# EAGLE design SimpleKeyboard (EAGLE 7.7.0)
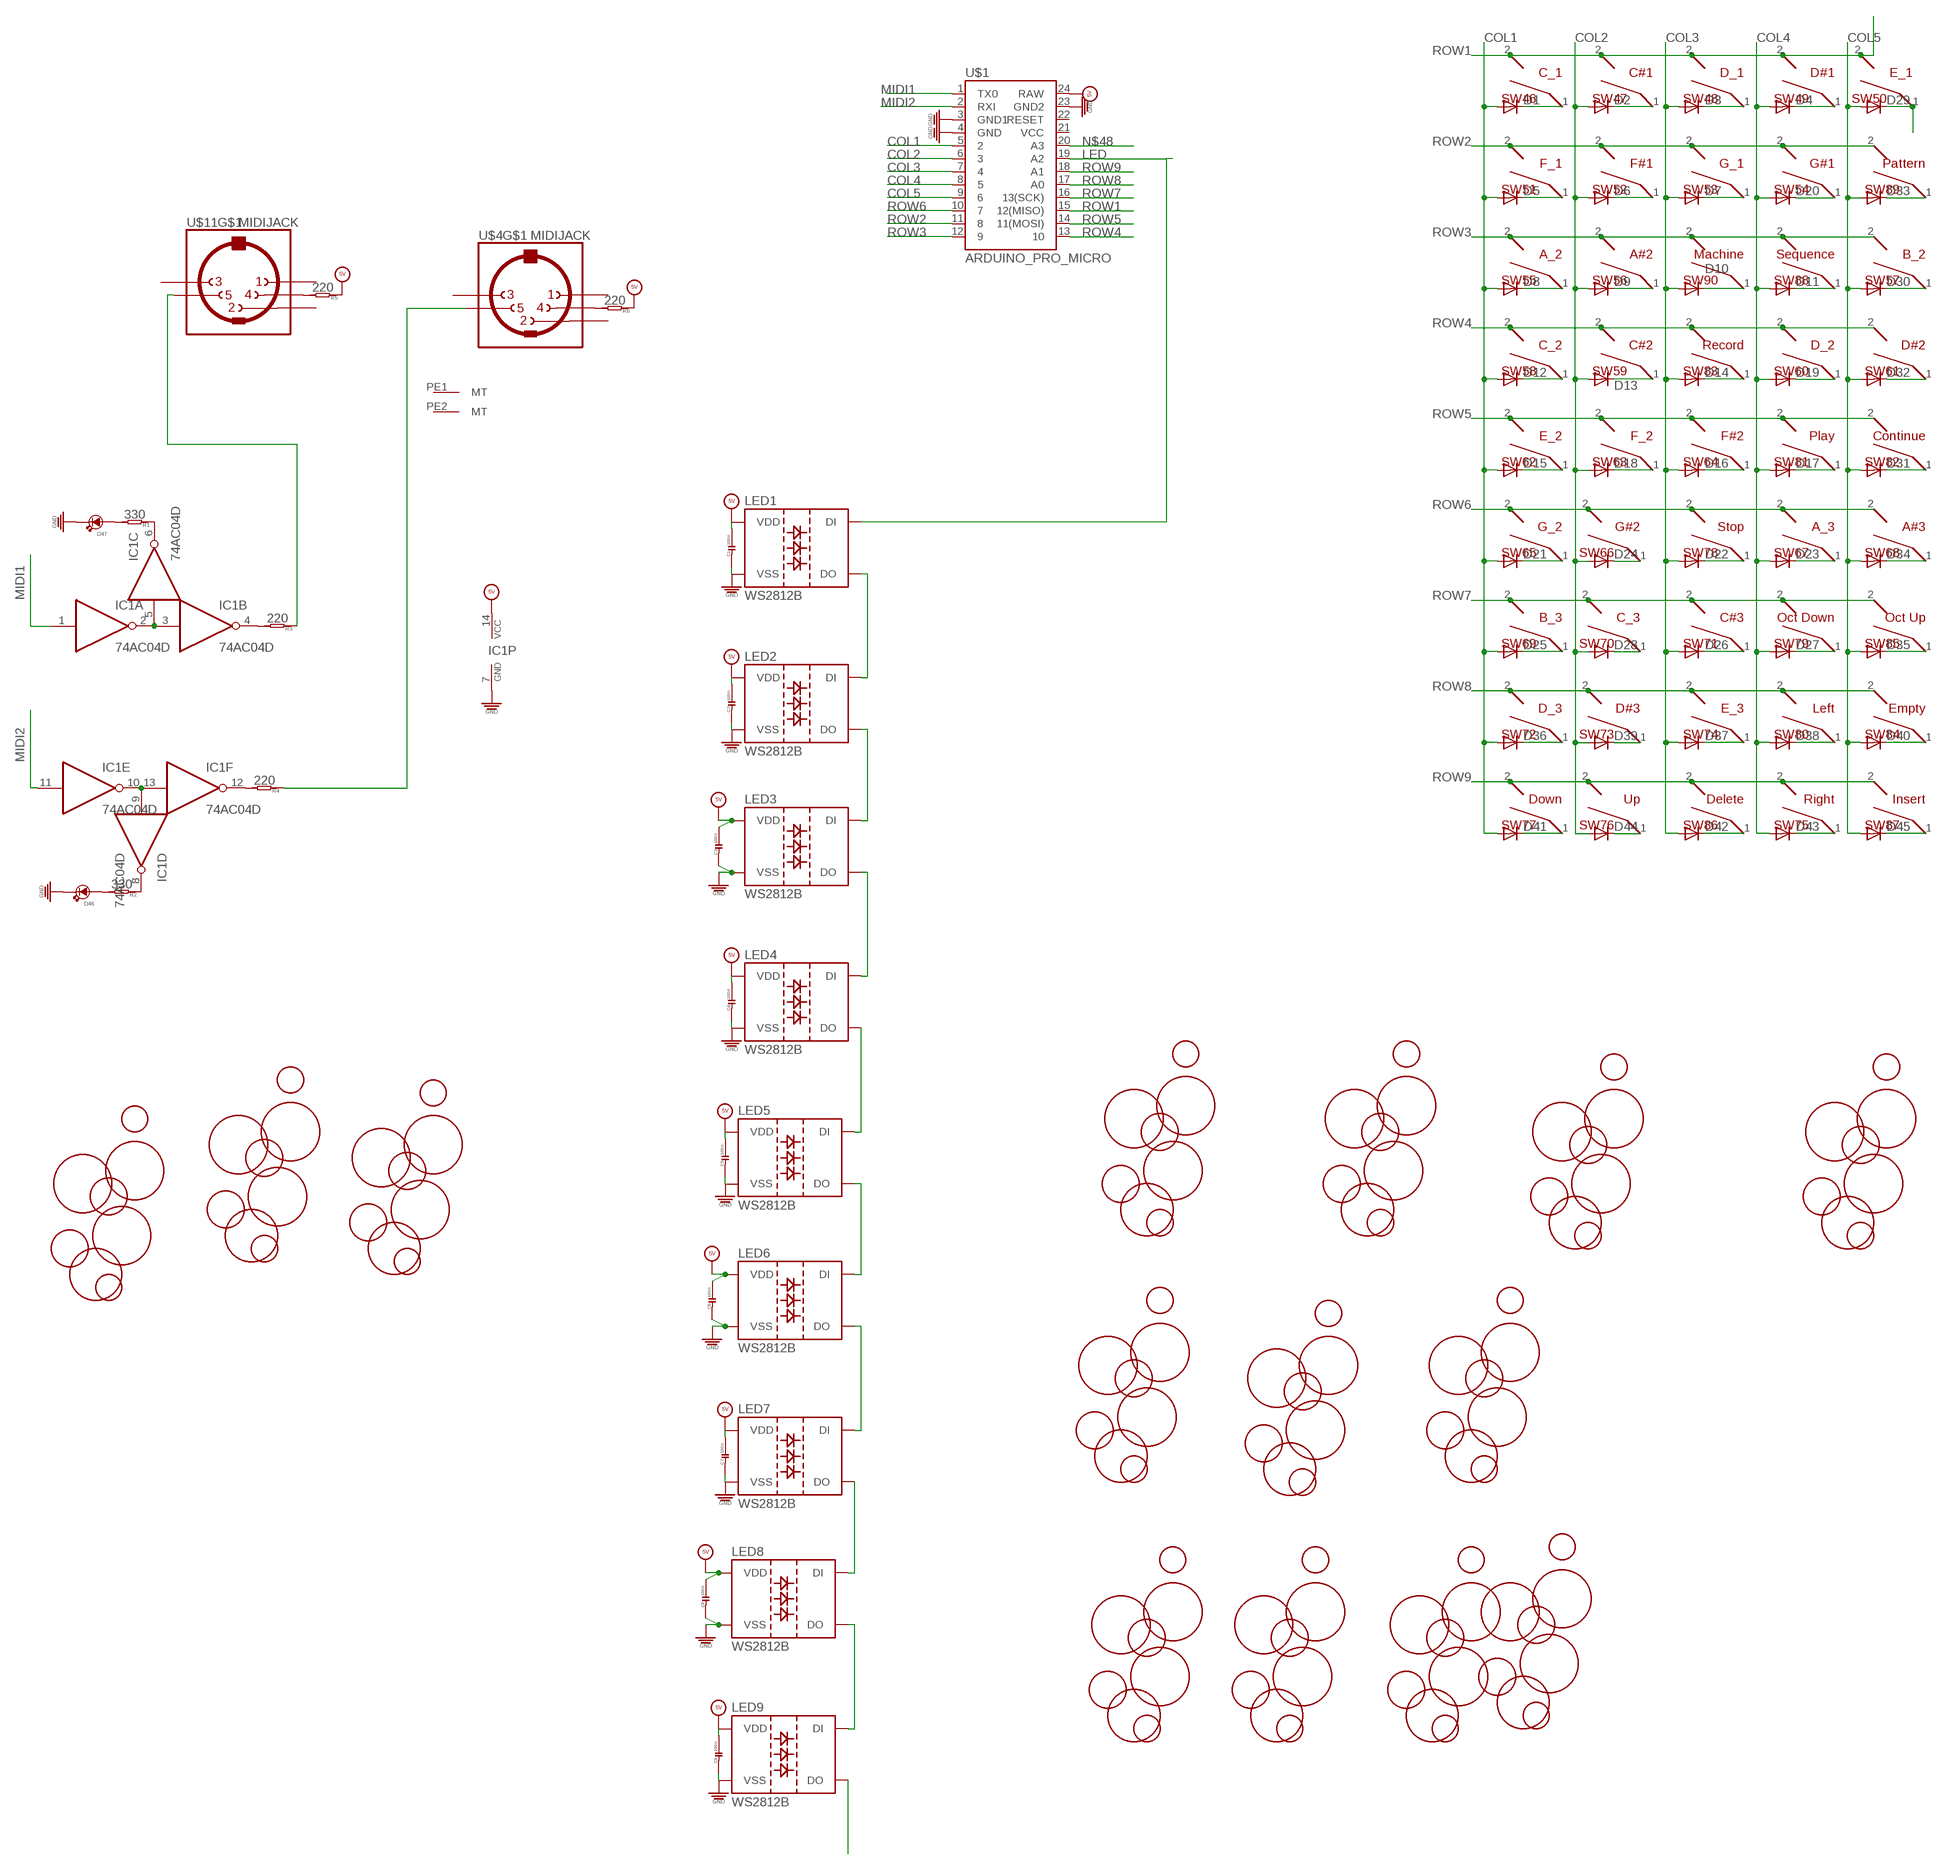
[diagram p0: schematic, sheet 1, part 1 of 2]
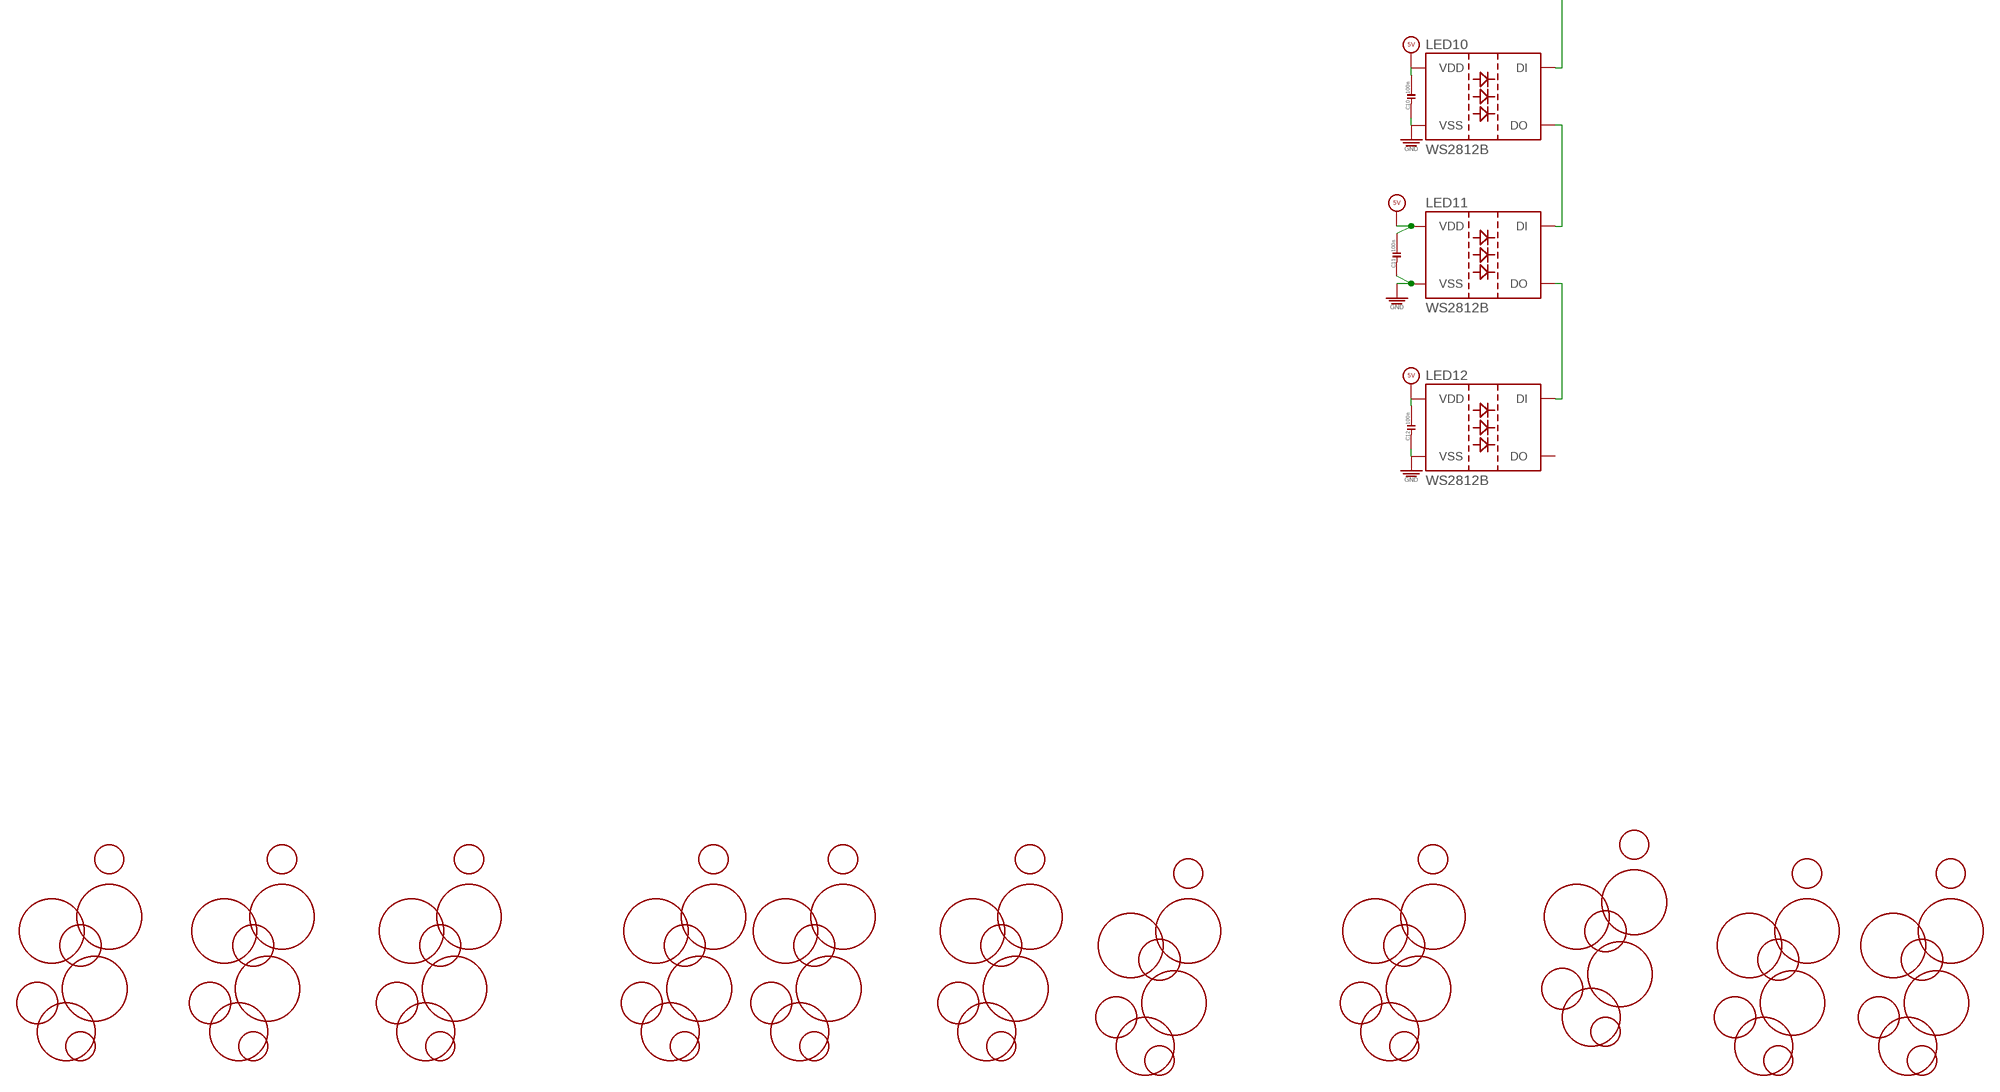
[diagram p1: schematic, sheet 1, part 2 of 2]

## Parts
C1  100n  C-0603  [C0603]
C2  100n  C-0603  [C0603]
C3  100n  C-0603  [C0603]
C4  100n  C-0603  [C0603]
C5  100n  C-0603  [C0603]
C6  100n  C-0603  [C0603]
C7  100n  C-0603  [C0603]
C8  100n  C-0603  [C0603]
C9  100n  C-0603  [C0603]
C10  100n  C-0603  [C0603]
C11  100n  C-0603  [C0603]
C12  100n  C-0603  [C0603]
D1  CGRM4001-G  [SOD-123_MINI-SMA]
D2  CGRM4001-G  [SOD-123_MINI-SMA]
D3  CGRM4001-G  [SOD-123_MINI-SMA]
D4  CGRM4001-G  [SOD-123_MINI-SMA]
D5  CGRM4001-G  [SOD-123_MINI-SMA]
D6  CGRM4001-G  [SOD-123_MINI-SMA]
D7  CGRM4001-G  [SOD-123_MINI-SMA]
D8  CGRM4001-G  [SOD-123_MINI-SMA]
D9  CGRM4001-G  [SOD-123_MINI-SMA]
D10  CGRM4001-G  [SOD-123_MINI-SMA]
D11  CGRM4001-G  [SOD-123_MINI-SMA]
D12  CGRM4001-G  [SOD-123_MINI-SMA]
D13  CGRM4001-G  [SOD-123_MINI-SMA]
D14  CGRM4001-G  [SOD-123_MINI-SMA]
D15  CGRM4001-G  [SOD-123_MINI-SMA]
D16  CGRM4001-G  [SOD-123_MINI-SMA]
D17  CGRM4001-G  [SOD-123_MINI-SMA]
D18  CGRM4001-G  [SOD-123_MINI-SMA]
D19  CGRM4001-G  [SOD-123_MINI-SMA]
D20  CGRM4001-G  [SOD-123_MINI-SMA]
D21  CGRM4001-G  [SOD-123_MINI-SMA]
D22  CGRM4001-G  [SOD-123_MINI-SMA]
D23  CGRM4001-G  [SOD-123_MINI-SMA]
D24  CGRM4001-G  [SOD-123_MINI-SMA]
D25  CGRM4001-G  [SOD-123_MINI-SMA]
D26  CGRM4001-G  [SOD-123_MINI-SMA]
D27  CGRM4001-G  [SOD-123_MINI-SMA]
D28  CGRM4001-G  [SOD-123_MINI-SMA]
D29  CGRM4001-G  [SOD-123_MINI-SMA]
D30  CGRM4001-G  [SOD-123_MINI-SMA]
D31  CGRM4001-G  [SOD-123_MINI-SMA]
D32  CGRM4001-G  [SOD-123_MINI-SMA]
D33  CGRM4001-G  [SOD-123_MINI-SMA]
D34  CGRM4001-G  [SOD-123_MINI-SMA]
D35  CGRM4001-G  [SOD-123_MINI-SMA]
D36  CGRM4001-G  [SOD-123_MINI-SMA]
D37  CGRM4001-G  [SOD-123_MINI-SMA]
D38  CGRM4001-G  [SOD-123_MINI-SMA]
D39  CGRM4001-G  [SOD-123_MINI-SMA]
D40  CGRM4001-G  [SOD-123_MINI-SMA]
D41  CGRM4001-G  [SOD-123_MINI-SMA]
D42  CGRM4001-G  [SOD-123_MINI-SMA]
D43  CGRM4001-G  [SOD-123_MINI-SMA]
D44  CGRM4001-G  [SOD-123_MINI-SMA]
D45  CGRM4001-G  [SOD-123_MINI-SMA]
D46  LED3MM  [3MMLED]
D47  LED3MM  [3MMLED]
IC1  74AC04D  [SO14]
LED1  WS2812B  [WS2812B]
LED2  WS2812B  [WS2812B]
LED3  WS2812B  [WS2812B]
LED4  WS2812B  [WS2812B]
LED5  WS2812B  [WS2812B]
LED6  WS2812B  [WS2812B]
LED7  WS2812B  [WS2812B]
LED8  WS2812B  [WS2812B]
LED9  WS2812B  [WS2812B]
LED10  WS2812B  [WS2812B]
LED11  WS2812B  [WS2812B]
LED12  WS2812B  [WS2812B]
R1  330  R-0603  [R0603]
R2  330  R-0603  [R0603]
R3  220  R-0603  [R0603]
R4  220  R-0603  [R0603]
R5  220  R-0603  [R0603]
R6  220  R-0603  [R0603]
SW46  C_1  CHERRY_MX_WITH_FIXING_PINS  [MX1A-XXNW]
SW47  C#1  CHERRY_MX_WITH_FIXING_PINS  [MX1A-XXNW]
SW48  D_1  CHERRY_MX_WITH_FIXING_PINS  [MX1A-XXNW]
SW49  D#1  CHERRY_MX_WITH_FIXING_PINS  [MX1A-XXNW]
SW50  E_1  CHERRY_MX_WITH_FIXING_PINS  [MX1A-XXNW]
SW51  F_1  CHERRY_MX_WITH_FIXING_PINS  [MX1A-XXNW]
SW52  F#1  CHERRY_MX_WITH_FIXING_PINS  [MX1A-XXNW]
SW53  G_1  CHERRY_MX_WITH_FIXING_PINS  [MX1A-XXNW]
SW54  G#1  CHERRY_MX_WITH_FIXING_PINS  [MX1A-XXNW]
SW55  A_2  CHERRY_MX_WITH_FIXING_PINS  [MX1A-XXNW]
SW56  A#2  CHERRY_MX_WITH_FIXING_PINS  [MX1A-XXNW]
SW57  B_2  CHERRY_MX_WITH_FIXING_PINS  [MX1A-XXNW]
SW58  C_2  CHERRY_MX_WITH_FIXING_PINS  [MX1A-XXNW]
SW59  C#2  CHERRY_MX_WITH_FIXING_PINS  [MX1A-XXNW]
SW60  D_2  CHERRY_MX_WITH_FIXING_PINS  [MX1A-XXNW]
SW61  D#2  CHERRY_MX_WITH_FIXING_PINS  [MX1A-XXNW]
SW62  E_2  CHERRY_MX_WITH_FIXING_PINS  [MX1A-XXNW]
SW63  F_2  CHERRY_MX_WITH_FIXING_PINS  [MX1A-XXNW]
SW64  F#2  CHERRY_MX_WITH_FIXING_PINS  [MX1A-XXNW]
SW65  G_2  CHERRY_MX_WITH_FIXING_PINS  [MX1A-XXNW]
SW66  G#2  CHERRY_MX_WITH_FIXING_PINS  [MX1A-XXNW]
SW67  A_3  CHERRY_MX_WITH_FIXING_PINS  [MX1A-XXNW]
SW68  A#3  CHERRY_MX_WITH_FIXING_PINS  [MX1A-XXNW]
SW69  B_3  CHERRY_MX_WITH_FIXING_PINS  [MX1A-XXNW]
SW70  C_3  CHERRY_MX_WITH_FIXING_PINS  [MX1A-XXNW]
SW71  C#3  CHERRY_MX_WITH_FIXING_PINS  [MX1A-XXNW]
SW72  D_3  CHERRY_MX_WITH_FIXING_PINS  [MX1A-XXNW]
SW73  D#3  CHERRY_MX_WITH_FIXING_PINS  [MX1A-XXNW]
SW74  E_3  CHERRY_MX_WITH_FIXING_PINS  [MX1A-XXNW]
SW75  Right  CHERRY_MX_WITH_FIXING_PINS  [MX1A-XXNW]
SW76  Up  CHERRY_MX_WITH_FIXING_PINS  [MX1A-XXNW]
SW77  Down  CHERRY_MX_WITH_FIXING_PINS  [MX1A-XXNW]
SW78  Stop  CHERRY_MX_WITH_FIXING_PINS  [MX1A-XXNW]
SW79  Oct Down  CHERRY_MX_WITH_FIXING_PINS  [MX1A-XXNW]
SW80  Left  CHERRY_MX_WITH_FIXING_PINS  [MX1A-XXNW]
SW81  Play  CHERRY_MX_WITH_FIXING_PINS  [MX1A-XXNW]
SW82  Continue  CHERRY_MX_WITH_FIXING_PINS  [MX1A-XXNW]
SW83  Record  CHERRY_MX_WITH_FIXING_PINS  [MX1A-XXNW]
SW84  Empty  CHERRY_MX_WITH_FIXING_PINS  [MX1A-XXNW]
SW85  Oct Up  CHERRY_MX_WITH_FIXING_PINS  [MX1A-XXNW]
SW86  Delete  CHERRY_MX_WITH_FIXING_PINS  [MX1A-XXNW]
SW87  Insert  CHERRY_MX_WITH_FIXING_PINS  [MX1A-XXNW]
SW88  Sequence  CHERRY_MX_WITH_FIXING_PINS  [MX1A-XXNW]
SW89  Pattern  CHERRY_MX_WITH_FIXING_PINS  [MX1A-XXNW]
SW90  Machine  CHERRY_MX_WITH_FIXING_PINS  [MX1A-XXNW]
U$1  ARDUINO_PRO_MICRO  [ARDUINO_PRO_MICRO]
U$4  MIDIJACK  [CP-2350]
U$11  MIDIJACK  [CP-2350]
U$15  BUBBLESDSA_1U  [BUBBLES]
U$16  BUBBLESDSA_1U  [BUBBLES]
U$17  BUBBLESDSA_1U  [BUBBLES]
U$18  BUBBLESDSA_1U  [BUBBLES]
U$19  BUBBLESDSA_1U  [BUBBLES]
U$20  BUBBLESDSA_1U  [BUBBLES]
U$21  BUBBLESDSA_1U_HALF  [BUBBLES_HALF]
U$22  BUBBLESDSA_1U_HALF  [BUBBLES_HALF]
U$28  BUBBLESINV  [BUBBLES_INV]
U$29  BUBBLESINV  [BUBBLES_INV]
U$30  BUBBLESINV  [BUBBLES_INV]
U$31  BUBBLESINV  [BUBBLES_INV]
U$32  BUBBLESINV  [BUBBLES_INV]
U$33  BUBBLESDSA_1U_HALF  [BUBBLES_HALF]
U$34  BUBBLESONE  [BUBBLES_ONE]
U$35  BUBBLESONE  [BUBBLES_ONE]
U$36  BUBBLESONE  [BUBBLES_ONE]
U$37  BUBBLESONE  [BUBBLES_ONE]
U$38  BUBBLESONE  [BUBBLES_ONE]
U$39  BUBBLESONE  [BUBBLES_ONE]
U$40  BUBBLESONE  [BUBBLES_ONE]
U$41  BUBBLESONE  [BUBBLES_ONE]
U$42  BUBBLESONE  [BUBBLES_ONE]
U$43  BUBBLESONE  [BUBBLES_ONE]
U$44  BUBBLESONE  [BUBBLES_ONE]

## Nets
5V: C1.2 C2.2 C3.2 C4.2 C5.2 C6.2 C7.2 C8.2 C9.2 C10.2 C11.2 C12.2 IC1.14(P:VCC) LED1.VDD LED2.VDD LED3.VDD LED4.VDD LED5.VDD LED6.VDD LED7.VDD LED8.VDD LED9.VDD LED10.VDD LED11.VDD LED12.VDD R5.1 R6.1 U$1.24(RAW)
COL1: D1.A D5.A D8.A D12.A D15.A D21.A D25.A D36.A D41.A U$1.5
COL2: D2.A D6.A D9.A D13.A D18.A D24.A D28.A D39.A D44.A U$1.6
COL3: D3.A D7.A D10.A D14.A D16.A D22.A D26.A D37.A D42.A U$1.7
COL4: D4.A D11.A D17.A D19.A D20.A D23.A D27.A D38.A D43.A U$1.8
COL5: D29.A D30.A D31.A D32.A D33.A D34.A D35.A D40.A D45.A U$1.9
GND: C1.1 C2.1 C3.1 C4.1 C5.1 C6.1 C7.1 C8.1 C9.1 C10.1 C11.1 C12.1 D46.- D47.- IC1.7(P:GND) LED1.VSS LED2.VSS LED3.VSS LED4.VSS LED5.VSS LED6.VSS LED7.VSS LED8.VSS LED9.VSS LED10.VSS LED11.VSS LED12.VSS U$1.3(GND1) U$1.4(GND) U$1.23(GND2)
LED: LED1.DIN(DI) U$1.19(A2)
MIDI1: IC1.1(A:I) U$1.1(TX0)
MIDI2: IC1.11(E:I) U$1.2(RXI)
N$1: D1.C SW46.1
N$2: D2.C SW47.1
N$3: D3.C SW48.1
N$4: D4.C SW49.1
N$5: D5.C SW51.1
N$6: D6.C SW52.1
N$7: D7.C SW53.1
N$8: D8.C SW55.1
N$9: D9.C SW56.1
N$10: D10.C SW90.1
N$11: D11.C SW88.1
N$12: D12.C SW58.1
N$13: D13.C SW59.1
N$14: D14.C SW83.1
N$15: D15.C SW62.1
N$16: D16.C SW64.1
N$17: D17.C SW81.1
N$18: D18.C SW63.1
N$19: D19.C SW60.1
N$20: D20.C SW54.1
N$21: D21.C SW65.1
N$22: D22.C SW78.1
N$23: D23.C SW67.1
N$24: D24.C SW66.1
N$25: D25.C SW69.1
N$26: D26.C SW71.1
N$27: D27.C SW79.1
N$28: D28.C SW70.1
N$29: D29.C SW50.1
N$30: D30.C SW57.1
N$31: D31.C SW82.1
N$32: D32.C SW61.1
N$33: D33.C SW89.1
N$34: D34.C SW68.1
N$35: D35.C SW85.1
N$36: D36.C SW72.1
N$37: D37.C SW74.1
N$38: D38.C SW80.1
N$39: D39.C SW73.1
N$40: D40.C SW84.1
N$41: D41.C SW77.1
N$42: D42.C SW86.1
N$43: D43.C SW75.1
N$44: D44.C SW76.1
N$45: D45.C SW87.1
N$46: D46.+ R2.2
N$47: LED3.DOUT(DO) LED4.DIN(DI)
N$48: U$1.20(A3)
N$49: LED2.DOUT(DO) LED3.DIN(DI)
N$50: LED1.DOUT(DO) LED2.DIN(DI)
N$51: LED8.DOUT(DO) LED9.DIN(DI)
N$52: LED6.DOUT(DO) LED7.DIN(DI)
N$53: LED5.DOUT(DO) LED6.DIN(DI)
N$54: LED4.DOUT(DO) LED5.DIN(DI)
N$55: IC1.2(A:O) IC1.3(B:I) IC1.5(C:I)
N$56: IC1.9(D:I) IC1.10(E:O) IC1.13(F:I)
N$57: IC1.6(C:O) R1.1
N$58: IC1.8(D:O) R2.1
N$59: D47.+ R1.2
N$60: IC1.4(B:O) R3.2
N$61: IC1.12(F:O) R4.2
N$62: R5.2 U$11.4
N$63: R6.2 U$4.4
N$64: R3.1 U$11.5
N$65: R4.1 U$4.5
N$66: LED7.DOUT(DO) LED8.DIN(DI)
N$67: LED11.DOUT(DO) LED12.DIN(DI)
N$68: LED10.DOUT(DO) LED11.DIN(DI)
N$69: LED9.DOUT(DO) LED10.DIN(DI)
ROW1: SW46.2 SW47.2 SW48.2 SW49.2 SW50.2 U$1.15(12(MISO))
ROW2: SW51.2 SW52.2 SW53.2 SW54.2 SW89.2 U$1.11
ROW3: SW55.2 SW56.2 SW57.2 SW88.2 SW90.2 U$1.12
ROW4: SW58.2 SW59.2 SW60.2 SW61.2 SW83.2 U$1.13
ROW5: SW62.2 SW63.2 SW64.2 SW81.2 SW82.2 U$1.14(11(MOSI))
ROW6: SW65.2 SW66.2 SW67.2 SW68.2 SW78.2 U$1.10
ROW7: SW69.2 SW70.2 SW71.2 SW79.2 SW85.2 U$1.16(13(SCK))
ROW8: SW72.2 SW73.2 SW74.2 SW80.2 SW84.2 U$1.17(A0)
ROW9: SW75.2 SW76.2 SW77.2 SW86.2 SW87.2 U$1.18(A1)
Unconnected: LED12.DOUT(DO) U$1.21(VCC) U$1.22(RESET) U$4.1 U$4.2 U$4.3 U$4.PE1(MT) U$4.PE2(MT) U$4.PE(MT) U$4.PE@(MT) U$11.1 U$11.2 U$11.3 U$11.PE1(MT) U$11.PE2(MT) U$11.PE(MT) U$11.PE@(MT)

## Library data of the parts
C1-C12 = OPL:C*
D1-D45 = diode:CGRM400*-G: Molded plasitc,JEDEC SOD-123/Mini SMA Source: Comchip CGRM4001-G.pdf
D46 D47 = EurorackModularParts:LED*: LED
IC1 = 74xx-eu:74*04: Hex INVERTER
LED1-LED12 = WS2812:WS2812B
R1-R6 = OPL:R*
SW46-SW90 = Cherry_MX_v7.0:CHERRY_MX
U$1 = SparkFun-Boards:ARDUINO_PRO_MICRO
U$4 U$11 = adafruit:MIDIJACK: DIN 5 jack also known as MIDI jack A modification of conn-hirshman:MAB5SH with two options for the grounding 'teeth'
U$15-U$22 U$28-U$44 = EurorackModularParts:BUBBLES

## Net classes
0 default: width 0.381 mm

## Board
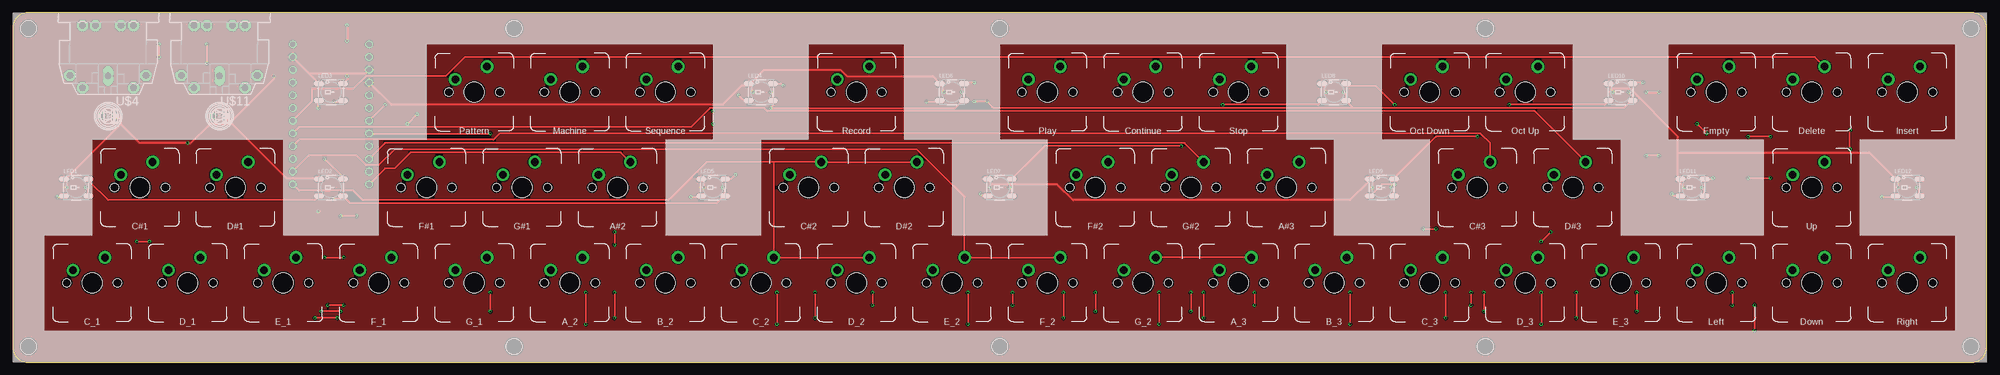
[diagram p2: board, top side]
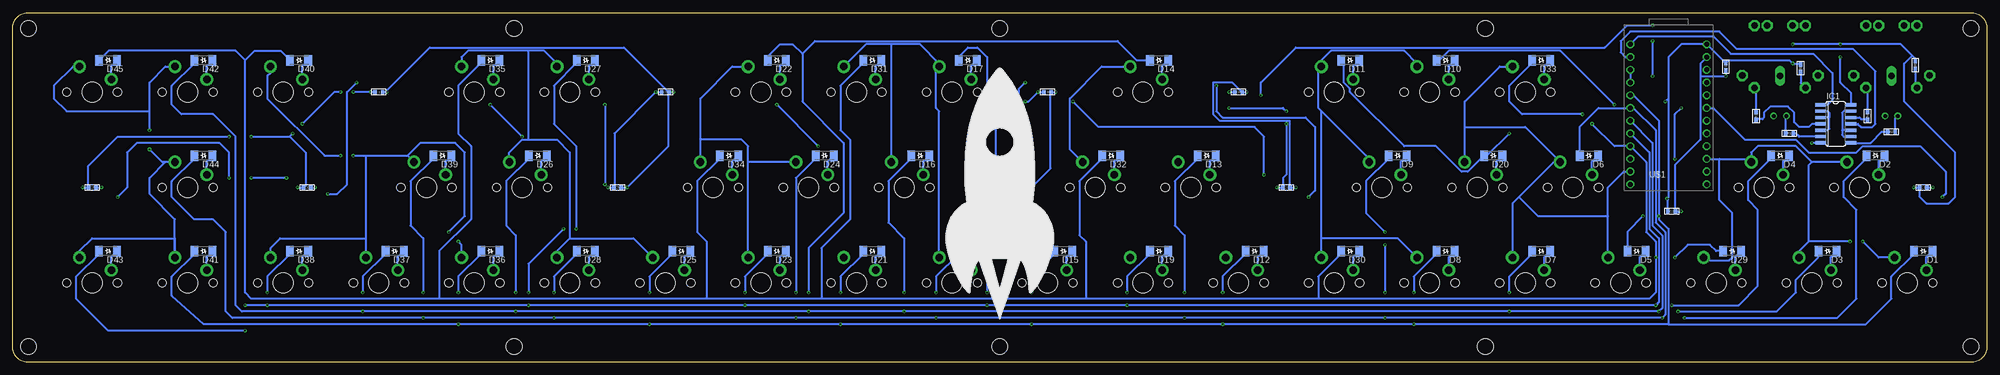
[diagram p3: board, bottom side, seen from below]

Size 393.7 x 69.85 mm. Coordinates in mm from the lower left corner, seen from the top.
Outline: 0,66.67 0,3.17 arc90 3.17,0 390.53,0 arc90 393.7,3.17 393.7,66.67 arc90 390.53,69.85 3.17,69.85 arc90 0,66.67
Copper layers (1*16): Top 0.035mm / dielectric 1.5mm / Bottom 0.035mm
Design rules "dirt_cheap_dirty_boards.v1": minimum track width 5mil, minimum drill 12mil, track to track 5mil, track to pad 5mil, pad to pad 5mil, via to via 5mil, smd to smd 0mil, copper to edge 10mil, drill to drill 10mil, minimum pad ring 10mil, minimum via ring 6mil, stop-mask expansion 2mil, vias tented up to drill 25mil, thermal gap 10mil
Holes 3.2 mm at 3.17,66.67 3.17,3.17 390.53,66.67 196.85,3.17 196.85,66.67 390.53,3.17 100.01,3.17 100.01,66.67 293.69,3.17 293.69,66.67

### Footprints (pad centres in the part's own frame; a part is rotated, then mirrored left to right if it is on the bottom)
C0603 = smd 0.889 x 0.889: 1 -0.762,0; 2 0.762,0
SOD-123_MINI-SMA = smd 1.5 x 2.1: A 1.8,0; C -1.8,0
3MMLED = drill 0.8: + -1.27,0; - 1.27,0
SO14 = smd 0.66 x 2.032: 1 -3.81,-3.073; 2 -2.54,-3.073; 3 -1.27,-3.073; 4 0,-3.073; 5 1.27,-3.073; 6 2.54,-3.073; 7 3.81,-3.073; 8 3.81,3.073; 9 2.54,3.073; 10 1.27,3.073; 11 0,3.073; 12 -1.27,3.073; 13 -2.54,3.073; 14 -3.81,3.073
WS2812B = smd 2 x 1.1: DIN -2.4,-1.7; DOUT 2.4,1.7; VDD 2.4,-1.7; VSS -2.4,1.7
R0603 = smd 0.889 x 0.889: 1 -0.762,0; 2 0.762,0
MX1A-XXNW = drill 1.5 pad 2.54: 1 -3.81,2.54; 2 2.54,5.08 | hole 4: 0,0 | hole 1.7: -5.08,0; 5.08,0
ARDUINO_PRO_MICRO = drill 1.016: 1 -7.62,12.7; 2 -7.62,10.16; 3 -7.62,7.62; 4 -7.62,5.08; 5 -7.62,2.54; 6 -7.62,0; 7 -7.62,-2.54; 8 -7.62,-5.08; 9 -7.62,-7.62; 10 -7.62,-10.16; 11 -7.62,-12.7; 12 -7.62,-15.24; 13 7.62,-15.24; 14 7.62,-12.7; 15 7.62,-10.16; 16 7.62,-7.62; 17 7.62,-5.08; 18 7.62,-2.54; 19 7.62,0; 20 7.62,2.54; 21 7.62,5.08; 22 7.62,7.62; 23 7.62,10.16; 24 7.62,12.7
CP-2350 = drill 1.321 pad 2.184 octagon: 1 7.62,12.58; 3 -7.52,12.58; 4 5.08,15.02; 5 -5.08,15.02; PE -2.54,2.62; PE1 -5.08,2.62; PE2 5.08,2.62; PE@ 2.54,2.62 | drill 1.321 long: 2 0,12.68

### Placement (x,y rotation side)
C1  12.7,34.92 180 bottom
C2  62.86,30.16 180 bottom
C3  139.7,34.92 180 bottom
C4  196.85,34.92 180 bottom
C5  273.05,34.92 180 bottom
C6  334.96,34.92 180 bottom
C7  377.82,34.92 180 bottom
C8  149.23,53.97 180 bottom
C9  263.53,53.97 180 bottom
C10  187.33,53.97 180 bottom
C11  320.68,53.97 180 bottom
C12  52.07,59.05 90 bottom
D1  12.7,22.23 180 bottom
D2  22.23,41.27 180 bottom
D3  31.75,22.23 180 bottom
D4  41.27,41.27 180 bottom
D5  69.85,22.23 180 bottom
D6  79.38,41.27 180 bottom
D7  88.9,22.23 180 bottom
D8  107.95,22.23 180 bottom
D9  117.47,41.27 180 bottom
D10  107.95,60.32 180 bottom
D11  127,60.32 180 bottom
D12  146.05,22.23 180 bottom
D13  155.58,41.27 180 bottom
D14  165.1,60.32 180 bottom
D15  184.15,22.23 180 bottom
D16  212.73,41.27 180 bottom
D17  203.2,60.32 180 bottom
D18  203.2,22.23 180 bottom
D19  165.1,22.23 180 bottom
D20  98.42,41.27 180 bottom
D21  222.25,22.23 180 bottom
D22  241.3,60.32 180 bottom
D23  241.3,22.23 180 bottom
D24  231.78,41.27 180 bottom
D25  260.35,22.23 180 bottom
D26  288.93,41.27 180 bottom
D27  279.4,60.32 180 bottom
D28  279.4,22.23 180 bottom
D29  50.8,22.23 180 bottom
D30  127,22.23 180 bottom
D31  222.25,60.32 180 bottom
D32  174.62,41.27 180 bottom
D33  88.9,60.32 180 bottom
D34  250.83,41.27 180 bottom
D35  298.45,60.32 180 bottom
D36  298.45,22.23 180 bottom
D37  317.5,22.23 180 bottom
D38  336.55,22.23 180 bottom
D39  307.98,41.27 180 bottom
D40  336.55,60.32 180 bottom
D41  355.6,22.23 180 bottom
D42  355.6,60.32 180 bottom
D43  374.65,22.23 180 bottom
D44  355.6,41.27 180 bottom
D45  374.65,60.32 180 bottom
D46  19.05,49.21 0 top
D47  41.27,49.21 0 top
IC1  30.16,47.62 270 bottom
LED1  12.7,34.92 0 top
LED2  63.5,34.92 0 top
LED3  63.5,53.97 0 top
LED4  149.23,53.97 0 top
LED5  139.7,34.92 0 top
LED6  187.33,53.97 0 top
LED7  196.85,34.92 0 top
LED8  263.53,53.97 0 top
LED9  273.05,34.92 0 top
LED10  320.68,53.97 0 top
LED11  334.96,34.92 0 top
LED12  377.82,34.92 0 top
R1  39.37,45.72 180 bottom
R2  19.05,46.04 0 bottom
R3  46.04,49.21 270 bottom
R4  23.81,49.21 270 bottom
R5  37.15,58.74 270 bottom
R6  14.29,59.37 270 bottom
SW46  15.88,15.88 0 top
SW47  25.4,34.92 0 top
SW48  34.92,15.88 0 top
SW49  44.45,34.92 0 top
SW50  53.97,15.88 0 top
SW51  73.02,15.88 0 top
SW52  82.55,34.92 0 top
SW53  92.08,15.88 0 top
SW54  101.6,34.92 0 top
SW55  111.12,15.88 0 top
SW56  120.65,34.92 0 top
SW57  130.18,15.88 0 top
SW58  149.23,15.88 0 top
SW59  158.75,34.92 0 top
SW60  168.28,15.88 0 top
SW61  177.8,34.92 0 top
SW62  187.33,15.88 0 top
SW63  206.38,15.88 0 top
SW64  215.9,34.92 0 top
SW65  225.43,15.88 0 top
SW66  234.95,34.92 0 top
SW67  244.48,15.88 0 top
SW68  254,34.92 0 top
SW69  263.53,15.88 0 top
SW70  282.57,15.88 0 top
SW71  292.1,34.92 0 top
SW72  301.62,15.88 0 top
SW73  311.15,34.92 0 top
SW74  320.68,15.88 0 top
SW75  377.82,15.88 0 top
SW76  358.78,34.92 0 top
SW77  358.78,15.88 0 top
SW78  244.48,53.97 0 top
SW79  282.57,53.97 0 top
SW80  339.73,15.88 0 top
SW81  206.38,53.97 0 top
SW82  225.43,53.97 0 top
SW83  168.28,53.97 0 top
SW84  339.73,53.97 0 top
SW85  301.62,53.97 0 top
SW86  358.78,53.97 0 top
SW87  377.82,53.97 0 top
SW88  130.18,53.97 0 top
SW89  92.08,53.97 0 top
SW90  111.12,53.97 0 top
U$1  63.5,50.8 0 bottom
U$4  19.05,69.85 180 top
U$11  41.27,69.85 180 top
U$15  63.5,34.92 0 top
U$16  139.7,34.92 0 top
U$17  196.85,34.92 0 top
U$18  273.05,34.92 90 top
U$19  377.82,34.92 90 top
U$20  330.2,34.92 0 top
U$21  9.52,34.92 0 top
U$22  342.9,34.92 180 top
U$28  73.02,53.97 0 top
U$29  149.23,53.97 90 top
U$30  187.33,53.97 0 top
U$31  263.53,53.97 0 top
U$32  320.68,53.97 90 top
U$33  63.5,53.97 180 top
U$34  327.03,44.45 0 top
U$35  193.68,44.45 0 top
U$36  60.32,44.45 0 top
U$37  142.88,44.45 0 top
U$38  66.67,44.45 0 top
U$39  57.15,53.97 0 top
U$40  57.15,47.62 0 top
U$41  57.15,60.32 0 top
U$42  269.88,44.45 0 top
U$43  346.07,31.75 0 top
U$44  346.07,38.1 0 top
U$45  [ROCKET-5CM]  196.85,31.75 0 bottom

### Tracks (layer width: path | path; a pad name or v marks a point on that pad's centre or on a via)
5V  (via drill 0.3)
  Top 0.381: v63.82,32.7 65.38,32.7 LED2.VDD 66.04,33.02 67.31,31.75 140.34,31.75 141.61,33.02 LED5.VDD 142.1,34.43 v141.61,34.92 | v151.13,53.97 151.62,53.48 LED4.VDD 151.62,51.29 v151.13,50.8 187.96,50.8 189.23,52.07 LED6.VDD 189.73,53.48 v189.23,53.97 | LED7.VDD 199.25,34.43 v198.76,34.92 | v265.43,53.97 265.93,53.48 LED8.VDD 266.06,52.07 267.34,50.8 | LED9.VDD 275.45,34.43 v274.95,34.92 | LED11.VDD 337.36,34.43 v336.87,34.92 | v322.26,53.97 323.07,53.16 LED10.VDD 322.58,52.07 321.31,50.8 267.34,50.8 | LED12.VDD 380.23,34.43 v379.73,34.92 | LED1.VDD 15.1,34.43 v14.61,34.92 | v64.14,52.07 65.7,52.07 LED3.VDD | v38.73,63.5 v38.73,59.69 | v29.21,60.96 v29.21,63.5 | v139.7,50.16 v139.7,47.62 | v191.77,52.07 v194.31,52.07 195.58,50.8 267.34,50.8 | v350.52,45.08 v346.07,45.08 | v325.75,53.97 v328.3,53.97 | v335.92,47.62 v337.82,45.72
  Bottom 0.381: C2.2 63.63,32.51 v63.82,32.7 63.5,33.02 63.5,52.7 | v151.13,53.97 C8.2 | C10.2 v189.23,53.97 191.14,52.07 v191.77,52.07 | v198.76,34.92 C4.2 197.61,48.77 v194.31,52.07 | C9.2 v265.43,53.97 273.69,45.72 273.69,34.92 C5.2 v274.95,34.92 | v336.87,34.92 C6.2 335.28,35.37 335.28,41.91 338.45,45.08 | v322.26,53.97 C11.2 v325.75,53.97 | v379.73,34.92 C7.2 378.59,39.24 372.75,45.08 v350.52,45.08 | v14.61,34.92 C1.2 13.46,33.15 12.07,31.75 7.62,31.75 6.35,33.02 6.35,41.91 16.51,52.07 16.51,59.69 14.92,61.28 | 63.5,52.7 63.5,60.96 60.96,63.5 U$1.24 52.39,60.01 C12.2 52.26,59.5 51.43,60.32 39.37,60.32 v38.73,59.69 37.34,59.69 R5.1 | 63.5,52.7 v64.14,52.07 | R6.1 14.29,60.64 14.92,61.28 | 14.92,61.28 17.14,63.5 v29.21,63.5 v38.73,63.5 | IC1.14 27.09,53.76 29.21,55.88 v29.21,60.96 | v141.61,34.92 C3.2 140.34,35.05 140.34,36.83 139.7,37.46 v139.7,47.62 | v151.13,50.8 140.34,50.8 v139.7,50.16 | v346.07,45.08 338.45,45.08 | v328.3,53.97 329.56,53.97 v335.92,47.62 | v337.82,45.72 338.45,45.08
COL1  (via drill 0.3)
  Top 0.381: v114.3,13.97 v114.3,7.62 | v152.4,13.97 v152.4,7.62 | v190.5,13.97 v190.5,7.62 | v228.6,13.97 v228.6,7.62 | v266.7,13.97 v266.7,7.62 | v304.8,13.97 v304.8,7.62 | v68.58,29.21 v65.41,29.21
  Bottom 0.381: U$1.5 70.48,53.34 65.41,48.26 v65.41,29.21 65.41,28.57 63.5,26.67 63.5,7.62 | 63.5,7.62 24.13,7.62 19.05,12.7 19.05,17.14 14.61,21.59 14.61,22.12 D1.A | 63.5,7.62 v114.3,7.62 v152.4,7.62 v190.5,7.62 v228.6,7.62 v266.7,7.62 v304.8,7.62 355.6,7.62 361.95,13.34 361.95,17.14 357.5,21.59 357.5,22.12 D41.A | D8.A 109.75,21.7 114.3,17.14 v114.3,13.97 | D12.A 147.85,21.7 152.4,17.14 v152.4,13.97 | D15.A 185.95,21.7 190.5,17.14 v190.5,13.97 | D21.A 224.05,21.7 228.6,17.14 v228.6,13.97 | D25.A 262.15,21.7 266.7,17.14 v266.7,13.97 | D36.A 300.25,21.7 304.8,17.14 v304.8,13.97 | D5.A 71.65,26.14 v68.58,29.21
COL2  (via drill 0.3)
  Top 0.381: v64.77,8.89 v60.32,8.89 | v209.55,13.97 v209.55,8.89 | v285.75,13.97 v285.75,8.89 | v237.49,13.97 v237.49,8.89 | v120.02,26.04 v120.02,23.5 | v120.02,13.97 v120.02,8.89 | v160.02,13.97 v160.02,8.89 | v311.79,13.97 v311.79,8.89
  Bottom 0.381: v60.32,8.89 29.85,8.89 26.04,12.7 26.04,30.48 28.57,33.02 28.57,36.2 24.13,40.64 24.13,41.17 D2.A | D44.A 357.5,41.17 357.5,40.64 361.95,36.2 361.95,33.02 357.5,28.57 353.69,28.57 351.16,26.04 351.16,10.16 349.88,8.89 v311.79,8.89 v285.75,8.89 v237.49,8.89 v209.55,8.89 v160.02,8.89 v120.02,8.89 v64.77,8.89 64.14,9.52 64.14,26.04 66.04,27.94 66.04,46.35 70.48,50.8 U$1.6 77.47,50.8 81.17,47.09 D6.A | D18.A 205,21.7 209.55,17.14 v209.55,13.97 | D28.A 281.2,21.7 285.75,17.14 v285.75,13.97 | D24.A 233.58,40.74 237.49,36.83 v237.49,13.97 | D9.A 119.27,40.74 123.83,36.2 123.83,29.85 v120.02,26.04 | v120.02,23.5 v120.02,13.97 | D13.A 157.38,40.74 161.93,36.2 161.93,27.3 160.02,25.4 v160.02,13.97 | D39.A 309.78,40.74 314.32,36.2 314.32,27.3 311.79,24.77 v311.79,13.97
COL3  (via drill 0.3)
  Top 0.381: v65.41,10.16 v61.59,10.16 | v95.25,13.97 v95.25,10.16 | v323.85,13.97 v323.85,10.16 | v215.9,13.97 v215.9,10.16 | v293.37,13.97 v293.37,10.16 | v234.95,13.97 v234.95,10.16 | U$1.7 v74.3,51.43
  Bottom 0.381: U$1.7 66.67,43.81 66.67,27.3 64.77,25.4 64.77,10.79 v65.41,10.16 v95.25,10.16 v215.9,10.16 v234.95,10.16 v293.37,10.16 v323.85,10.16 347.98,10.16 349.25,11.43 349.25,45.08 353.69,49.53 360.05,49.53 361.95,51.43 361.95,55.24 357.5,59.69 357.5,60.22 D42.A | v61.59,10.16 41.91,10.16 38.1,13.97 38.1,16.51 33.66,20.96 33.66,22.12 D3.A | v95.25,13.97 95.25,17.14 90.8,21.59 90.8,22.12 D7.A | D37.A 319.3,21.7 323.85,17.14 v323.85,13.97 | D16.A 214.53,40.74 219.08,36.2 219.08,27.94 215.9,24.77 v215.9,13.97 | D26.A 290.73,40.74 295.28,36.2 295.28,27.3 293.37,25.4 v293.37,13.97 | D22.A 243.1,61.06 240.67,63.5 238.12,63.5 236.22,61.59 | 236.22,61.59 236.22,52.07 227.97,43.81 227.97,29.85 234.95,22.86 v234.95,13.97 | v74.3,51.43 85.09,62.23 107.31,62.23 109.22,60.32 D10.A | D14.A 169.55,60.32 173.36,64.14 233.68,64.14 236.22,61.59
COL4  (via drill 0.3)
  Top 0.381: v66.04,11.43 v62.86,11.43 | v347.35,11.43 v347.35,6.35 | v171.45,13.97 v171.45,11.43 | v247.65,13.97 v247.65,11.43 | v342.9,13.97 v342.9,11.43 | v199.39,13.97 v199.39,11.43 | v281.31,26.67 v283.85,26.67 | v290.83,13.97 v290.83,11.43 | U$1.8 v95.25,45.72
  Bottom 0.381: U$1.8 67.31,41.91 67.31,26.67 65.41,24.77 65.41,12.07 v66.04,11.43 v171.45,11.43 v199.39,11.43 v247.65,11.43 v290.83,11.43 v342.9,11.43 v347.35,11.43 | v62.86,11.43 49.53,11.43 45.72,15.24 45.72,30.48 47.62,32.38 47.62,36.2 43.18,40.64 43.18,41.17 D4.A | v347.35,6.35 374.65,6.35 381,12.7 381,17.14 376.56,21.59 376.56,22.12 D43.A | D19.A 166.9,21.7 171.45,17.14 v171.45,13.97 | D23.A 243.1,21.7 247.65,17.14 v247.65,13.97 | D38.A 338.35,21.7 342.9,17.14 v342.9,13.97 | D17.A 205,61.06 203.2,62.86 201.3,62.86 199.39,60.96 199.39,45.72 202.56,42.54 202.56,28.57 199.39,25.4 v199.39,13.97 | D27.A 281.2,59.79 285.75,55.24 285.75,47.62 281.31,43.18 v281.31,26.67 | v283.85,26.67 290.83,19.69 v290.83,13.97 | v95.25,45.72 99.69,41.27 D20.A 100.33,41.27 103.5,38.1 104.77,38.1 109.86,43.18 116.2,43.18 127,53.97 127,54.61 128.27,55.88 128.27,60.32 D11.A
COL5  (via drill 0.3)
  Top 0.381: v62.23,20.96 v66.04,20.96 | v78.74,47.62 v80.64,49.53
  Bottom 0.381: D29.A 53.97,22.23 55.24,23.5 59.69,23.5 v62.23,20.96 | 133.35,12.7 67.31,12.7 66.04,13.97 v66.04,20.96 66.04,24.13 67.94,26.04 67.94,40 U$1.9 74.3,43.18 v78.74,47.62 | 133.35,12.7 179.71,12.7 | 179.71,12.7 232.41,12.7 | 232.41,12.7 255.27,12.7 | 255.27,12.7 308.61,12.7 | 308.61,12.7 346.07,12.7 347.35,13.97 347.35,60.32 | 347.35,60.32 345.44,62.23 340.25,62.23 D40.A | 347.35,60.32 349.25,62.23 374.55,62.23 D45.A | D30.A 128.8,21.7 133.35,17.14 133.35,12.7 | v80.64,49.53 92.71,49.53 95.25,52.07 95.25,55.24 90.8,59.69 90.8,60.22 D33.A | D32.A 176.43,40.74 180.98,36.2 180.98,25.4 179.71,24.13 179.71,12.7 | D34.A 252.62,40.74 257.18,36.2 257.18,26.04 255.27,24.13 255.27,12.7 | D35.A 300.25,59.79 304.8,55.24 304.8,45.72 302.26,43.18 302.26,28.57 308.61,22.23 308.61,12.7 | D31.A 224.05,59.79 228.6,55.24 228.6,46.35 226.7,44.45 226.7,28.57 232.41,22.86 232.41,12.7
GND  (via drill 0.3)
  Top 0.381: v60.96,30.16 61.28,30.16 | v147.64,53.97 147.32,53.97 147.32,55.24 LED4.VSS | v185.74,53.97 185.42,53.97 185.42,55.24 LED6.VSS 184.79,55.88 183.52,57.15 166.37,57.15 165.1,58.42 149.86,58.42 147.32,55.88 LED4.VSS | 194.63,34.92 v194.95,34.92 194.95,35.56 | v261.94,53.97 261.62,53.97 261.62,55.24 LED8.VSS | 270.83,34.92 v271.15,34.92 271.15,36.2 LED9.VSS 270.51,36.2 266.7,32.38 211.46,32.38 208.28,35.56 194.95,35.56 | 333.06,34.92 v333.38,34.92 332.11,36.2 LED11.VSS 332.11,36.83 332.11,41.91 | v319.09,53.97 318.77,53.97 | 318.77,53.97 318.45,53.97 | 375.6,34.92 v375.92,34.92 375.92,36.2 LED12.VSS 375.29,36.83 370.2,41.91 332.11,41.91 | 10.16,34.92 v10.79,34.92 10.79,36.2 LED1.VSS 10.79,36.83 21.59,47.62 | v52.07,57.15 52.07,56.52 43.81,48.26 43.18,48.26 | 137.16,34.92 v137.8,34.92 137.8,36.2 LED5.VSS | U$1.23 59.05,57.78 | 59.05,57.78 60.96,55.88 LED3.VSS | U$1.3 70.48,57.78 59.05,57.78 | 21.59,47.62 21.59,48.89 20.32,48.89 D46.- | 43.18,48.26 42.54,48.89 D47.- | 43.18,48.26 43.81,47.62 | 43.81,47.62 54.61,36.83 60.96,36.83 LED2.VSS | 43.81,47.62 39.37,47.62 35.56,43.81 v34.92,43.81 25.4,43.81 21.59,47.62 | 194.95,35.56 194.95,36.2 LED7.VSS | 318.77,54.61 318.77,55.24 LED10.VSS | 318.77,54.61 318.77,53.97 | 318.77,54.61 322.58,54.61 332.11,45.08 332.11,41.91 | U$1.4 75.56,51.43 141.61,51.43 145.42,55.24 146.69,55.24 LED4.VSS
  Bottom 0.381: v60.96,30.16 C2.1 62.23,30.48 62.23,39.37 57.15,44.45 57.15,57.15 | v147.64,53.97 C8.1 148.59,53.97 150.5,55.88 154.31,55.88 154.31,49.53 153.04,48.26 139.06,48.26 139.06,34.92 C3.1 v137.8,34.92 | v185.74,53.97 C10.1 186.69,53.97 186.69,38.73 192.41,33.02 193.68,33.02 195.58,34.92 | C4.1 195.58,34.92 | 195.58,34.92 v194.95,34.92 | v261.94,53.97 C9.1 262.89,53.97 | C5.1 v271.15,34.92 262.89,43.18 262.89,53.97 | C6.1 v333.38,34.92 | C11.1 319.41,53.97 | 319.41,53.97 v319.09,53.97 | C7.1 v375.92,34.92 | C1.1 v10.79,34.92 | C12.1 v52.07,57.15 57.15,57.15 | IC1.7 v34.92,43.81 | U$1.3 U$1.4 | 57.15,57.15 57.15,59.69 U$1.23 | 262.89,53.97 271.78,62.86 310.51,62.86 319.41,53.97
  pour Top: -4.45,61.59 -6.03,-32.7 409.89,-9.21 412.12,80.33 8.89,75.88 arc90
LED  (via drill 0.3)
  Top 0.381: v8.89,33.02 10.09,33.02 LED1.DIN
  Bottom 0.381: U$1.19 54.61,50.8 48.26,44.45 38.1,44.45 35.56,41.91 26.04,41.91 24.77,43.18 13.34,43.18 8.25,38.1 8.25,33.66 v8.89,33.02
MIDI1
  Bottom 0.381: U$1.1 69.53,65.09 54.61,65.09 51.12,61.59 34.61,61.59 30.8,57.78 30.8,52.39 31.75,51.43 IC1.1
MIDI2
  Bottom 0.381: IC1.11 25.72,47.62 25.08,46.99 22.86,46.99 22.23,47.62 22.23,58.1 26.67,62.55 49.85,62.55 53.34,66.04 71.12,66.04 73.02,64.14 73.02,61.91 72.07,60.96 U$1.2
N$1
  Bottom 0.381: SW46.1 12.07,21.06 D1.C
N$2
  Bottom 0.381: D2.C 21.59,40.11 SW47.1
N$3
  Bottom 0.381: SW48.1 31.12,21.06 D3.C
N$4
  Bottom 0.381: D4.C 40.64,40.11 SW49.1
N$5
  Bottom 0.381: SW51.1 69.22,21.06 D5.C
N$6
  Bottom 0.381: SW52.1 78.74,40.11 D6.C
N$7
  Bottom 0.381: SW53.1 88.27,21.06 D7.C
N$8
  Bottom 0.381: SW55.1 107.31,21.06 D8.C
N$9
  Bottom 0.381: SW56.1 116.84,40.11 D9.C
N$10
  Bottom 0.381: SW90.1 107.31,59.16 D10.C
N$11
  Bottom 0.381: SW88.1 126.36,59.16 D11.C
N$12
  Bottom 0.381: SW58.1 145.42,21.06 D12.C
N$13
  Bottom 0.381: SW59.1 154.94,40.11 D13.C
N$14
  Bottom 0.381: SW83.1 164.47,59.16 D14.C
N$15
  Bottom 0.381: SW62.1 183.52,21.06 D15.C
N$16
  Bottom 0.381: SW64.1 212.09,40.11 D16.C
N$17
  Bottom 0.381: SW81.1 202.56,59.16 D17.C
N$18
  Bottom 0.381: SW63.1 202.56,21.06 D18.C
N$19
  Bottom 0.381: SW60.1 164.47,21.06 D19.C
N$20
  Bottom 0.381: SW54.1 97.79,40.11 D20.C
N$21
  Bottom 0.381: SW65.1 221.62,21.06 D21.C
N$22
  Bottom 0.381: SW78.1 240.67,59.16 D22.C
N$23
  Bottom 0.381: SW67.1 240.67,21.06 D23.C
N$24
  Bottom 0.381: SW66.1 231.14,40.11 D24.C
N$25
  Bottom 0.381: SW69.1 259.72,21.06 D25.C
N$26
  Bottom 0.381: SW71.1 288.29,40.11 D26.C
N$27
  Bottom 0.381: SW79.1 278.76,59.16 D27.C
N$28
  Bottom 0.381: SW70.1 278.76,21.06 D28.C
N$29
  Bottom 0.381: SW50.1 50.16,21.06 D29.C
N$30
  Bottom 0.381: SW57.1 126.36,21.06 D30.C
N$31
  Bottom 0.381: SW82.1 221.62,59.16 D31.C
N$32
  Bottom 0.381: SW61.1 173.99,40.11 D32.C
N$33
  Bottom 0.381: SW89.1 88.27,59.16 D33.C
N$34
  Bottom 0.381: SW68.1 250.19,40.11 D34.C
N$35
  Bottom 0.381: SW85.1 297.81,59.16 D35.C
N$36
  Bottom 0.381: SW72.1 297.81,21.06 D36.C
N$37
  Bottom 0.381: SW74.1 316.87,21.06 D37.C
N$38
  Bottom 0.381: SW80.1 335.92,21.06 D38.C
N$39
  Bottom 0.381: SW73.1 307.34,40.11 D39.C
N$40
  Bottom 0.381: SW84.1 335.92,59.16 D40.C
N$41
  Bottom 0.381: SW77.1 354.97,21.06 D41.C
N$42
  Bottom 0.381: SW86.1 354.97,59.16 D42.C
N$43
  Bottom 0.381: SW75.1 374.01,21.06 D43.C
N$44
  Bottom 0.381: SW76.1 354.97,40.11 D44.C
N$45
  Bottom 0.381: SW87.1 374.01,59.16 D45.C
N$46
  Bottom 0.381: R2.2 18.29,48.7 D46.+
N$47  (via drill 0.3)
  Top 0.381: LED4.DIN 145.84,52.27 v144.78,53.34 | v66.67,67.31 v66.67,64.14 | v66.67,57.15 66.67,56.45 LED3.DOUT
  Bottom 0.381: v144.78,53.34 144.78,55.88 137.8,62.86 76.2,62.86 71.75,67.31 v66.67,67.31 | v66.67,64.14 v66.67,57.15
N$49  (via drill 0.3)
  Top 0.381: LED2.DOUT 65.9,36.97 v62.23,40.64 | v60.96,50.8 60.96,52.13 LED3.DIN
  Bottom 0.381: v62.23,40.64 62.23,49.53 v60.96,50.8
N$50
  Top 0.381: LED1.DOUT 15.24,36.2 19.05,32.38 60.32,32.38 60.96,33.02 LED2.DIN
N$51  (via drill 0.3)
  Top 0.381: v275.59,35.56 273.05,35.56 271.15,33.66 LED9.DIN | v275.59,51.43 271.78,55.24 266.06,55.24 LED8.DOUT
  Bottom 0.381: v275.59,51.43 v275.59,35.56
N$52  (via drill 0.3)
  Top 0.381: LED7.DIN 193.47,33.23 v193.04,33.66 | v191.77,55.88 189.93,55.88 LED6.DOUT
  Bottom 0.381: v193.04,33.66 193.04,54.61 v191.77,55.88
N$53  (via drill 0.3)
  Top 0.381: LED5.DOUT 143.31,36.62 v144.15,37.46 | v182.25,52.07 184.72,52.07 LED6.DIN
  Bottom 0.381: v144.15,37.46 144.15,45.08 146.05,46.99 177.17,46.99 v182.25,52.07
N$54  (via drill 0.3)
  Top 0.381: LED4.DOUT 153.24,55.67 v153.67,55.24 | v135.26,33.02 137.09,33.02 LED5.DIN
  Bottom 0.381: v153.67,55.24 153.67,50.16 152.4,48.89 135.89,48.89 133.99,46.99 133.99,34.29 v135.26,33.02
N$55
  Bottom 0.381: IC1.5 31.75,46.35 31.43,46.67 31.43,48.89 | 31.43,48.89 IC1.3 | IC1.2 31.75,50.16 31.43,49.85 31.43,48.89
N$56
  Bottom 0.381: IC1.13 28.57,50.16 28.89,49.85 28.89,46.35 | 28.89,46.35 28.89,45.4 28.57,45.08 IC1.9 | IC1.10 28.89,46.35
N$57
  Bottom 0.381: IC1.6 37.46,45.08 38.1,45.72 R1.1
N$58
  Bottom 0.381: IC1.8 23.18,43.81 20.96,46.04 R2.1
N$59
  Bottom 0.381: R1.2 40.13,49.08 D47.+
N$60
  Bottom 0.381: IC1.4 34.92,47.62 35.56,46.99 37.46,46.99 38.42,47.94 38.42,49.85 39.69,51.12 43.18,51.12 44.45,49.85 44.45,48.89 44.77,48.58 45.91,48.58 R3.2
N$61
  Bottom 0.381: IC1.12 25.4,48.89 25.08,48.58 23.94,48.58 R4.2
N$62
  Bottom 0.381: R5.2 37.15,55.78 U$11.4
N$63
  Bottom 0.381: R6.2 14.29,54.51 U$4.4
N$64
  Bottom 0.381: R3.1 46.04,54.51 U$11.5
N$65
  Bottom 0.381: R4.1 23.81,54.51 U$4.5
N$66  (via drill 0.3)
  Top 0.381: v233.05,43.18 205.74,43.18 199.39,36.83 LED7.DOUT | v241.3,51.43 260.35,51.43 260.99,52.07 LED8.DIN
  Bottom 0.381: v241.3,51.43 v233.05,43.18
N$67  (via drill 0.3)
  Top 0.381: LED11.DOUT 338.88,36.62 v339.09,36.83 | v346.07,36.83 v350.52,36.83 | v372.75,33.02 375.22,33.02 LED12.DIN
  Bottom 0.381: v339.09,36.83 v346.07,36.83 | v350.52,36.83 350.52,41.91 352.43,43.81 368.94,43.81 370.84,41.91 370.84,34.92 v372.75,33.02
N$68  (via drill 0.3)
  Top 0.381: LED11.DIN 331.26,33.23 v330.84,33.66 | v325.12,55.88 323.28,55.88 LED10.DOUT
  Bottom 0.381: v330.84,33.66 328.93,33.66 327.03,35.56 327.03,53.97 v325.12,55.88
N$69  (via drill 0.3)
  Top 0.381: v292.1,45.08 283.85,45.08 275.59,36.83 LED9.DOUT | v298.45,51.43 317.5,51.43 318.13,52.07 LED10.DIN
  Bottom 0.381: v298.45,51.43 v292.1,45.08
ROW1  (via drill 0.3)
  Top 0.381: v24.77,24.13 v27.3,24.13
  Bottom 0.381: U$1.15 53.34,40.64 | 53.34,40.64 47.62,40.64 SW49.2 46.99,41.91 45.72,43.18 38.1,43.18 34.92,40 | SW50.2 55.88,20.96 55.24,20.32 51.43,20.32 50.8,20.96 50.8,29.85 53.34,32.38 53.34,40.64 | SW47.2 34.92,40 | SW46.2 21.59,20.96 v24.77,24.13 | v27.3,24.13 35.56,24.13 | 35.56,24.13 37.46,22.23 SW48.2 | 35.56,24.13 35.56,39.37 34.92,40
ROW2
  Bottom 0.381: SW54.2 104.14,46.99 | 104.14,46.99 104.14,52.07 97.16,59.05 SW89.2 | SW51.2 75.56,29.21 | 75.56,29.21 75.56,34.92 72.39,38.1 U$1.11 | 93.34,33.02 86.36,40 SW52.2 92.08,46.99 104.14,46.99 | 93.34,33.02 94.61,31.75 SW53.2 | 93.34,33.02 89.53,29.21 75.56,29.21
ROW3
  Top 0.381: U$1.12 74.3,38.73 76.2,38.73 79.38,41.91 121.28,41.91 SW56.2
  Bottom 0.381: SW90.2 113.66,59.69 116.2,62.23 130.81,62.23 132.72,60.32 SW88.2 133.35,58.42 133.35,50.8 132.72,50.16 | SW56.2 123.19,40.64 132.72,50.16 | SW57.2 132.72,24.77 | 132.72,24.77 132.72,50.16 | SW55.2 117.47,24.77 132.72,24.77
ROW4
  Top 0.381: U$1.13 57.15,34.29 67.94,34.29 69.85,32.38 130.81,32.38 138.43,40 151.77,40 | 151.77,40 SW59.2 SW61.2 | 151.77,40 SW58.2 SW60.2
  Bottom 0.381: SW83.2 176.53,59.05 182.88,52.7 182.88,42.54 SW61.2
ROW5
  Top 0.381: U$1.14 59.05,41.27 68.58,41.27 70.48,39.37 73.02,39.37 76.2,42.54 180.34,42.54 189.87,33.02 SW62.2 SW63.2
  Bottom 0.381: 218.44,63.5 212.73,63.5 208.92,59.69 SW81.2 209.55,58.42 209.55,50.8 208.92,50.16 SW63.2 | 218.44,63.5 223.52,63.5 SW82.2 | SW64.2 218.44,63.5
ROW6
  Top 0.381: U$1.10 74.3,43.81 233.68,43.81 SW66.2 | SW67.2 SW65.2
  Bottom 0.381: SW68.2 256.54,44.45 | 256.54,44.45 256.54,52.7 250.19,59.05 SW78.2 | SW67.2 247.02,40 | 247.02,40 247.02,43.18 248.29,44.45 256.54,44.45 | SW66.2 247.02,40
ROW7
  Top 0.381: U$1.16 57.15,44.45 95.88,44.45 97.16,45.72 292.74,45.72 294.64,43.81 SW71.2
  Bottom 0.381: SW79.2 285.12,59.69 287.66,62.23 290.83,62.23 | 290.83,62.23 302.9,62.23 304.17,60.96 SW85.2 | SW70.2 285.12,22.23 282.57,24.77 | 282.57,24.77 269.88,24.77 SW69.2 | SW71.2 294.64,41.91 292.1,44.45 290.83,44.45 | 290.83,44.45 285.12,44.45 282.57,41.91 282.57,24.77 | 290.83,44.45 290.83,62.23
ROW8  (via drill 0.3)
  Top 0.381: v328.3,41.27 v325.75,41.27 | v304.8,24.13 v306.7,26.04 | U$1.17 57.15,46.99 135.26,46.99 139.06,50.8 149.86,50.8 150.5,50.16 303.53,50.16 SW73.2
  Bottom 0.381: SW84.2 342.26,57.78 342.9,57.15 342.9,52.7 331.47,41.27 v328.3,41.27 | v325.75,41.27 323.22,41.27 | 323.22,41.27 314.96,41.27 | 314.96,41.27 SW73.2 | SW74.2 323.22,24.77 | 323.22,24.77 323.22,41.27 | SW80.2 342.26,22.86 340.36,24.77 323.22,24.77 | SW72.2 304.17,23.5 v304.8,24.13 | v306.7,26.04 303.53,29.21 303.53,41.91 305.44,43.81 312.42,43.81 314.96,41.27
ROW9  (via drill 0.3)
  Top 0.381: v366.4,42.54 v366.4,46.35 | U$1.18 59.69,52.07 59.69,54.61 67.94,54.61 70.48,57.15 86.36,57.15 90.17,60.96 359.41,60.96 SW86.2
  Bottom 0.381: SW75.2 380.37,22.23 377.82,24.77 361.31,24.77 SW77.2 361.31,28.57 366.4,33.66 366.4,36.83 363.22,40 | SW76.2 363.22,40 | 366.4,50.16 366.4,55.88 363.22,59.05 SW86.2 | SW87.2 381.63,59.05 385.44,55.24 385.44,52.7 382.91,50.16 366.4,50.16 | 363.22,40 363.86,40 v366.4,42.54 | v366.4,46.35 366.4,50.16